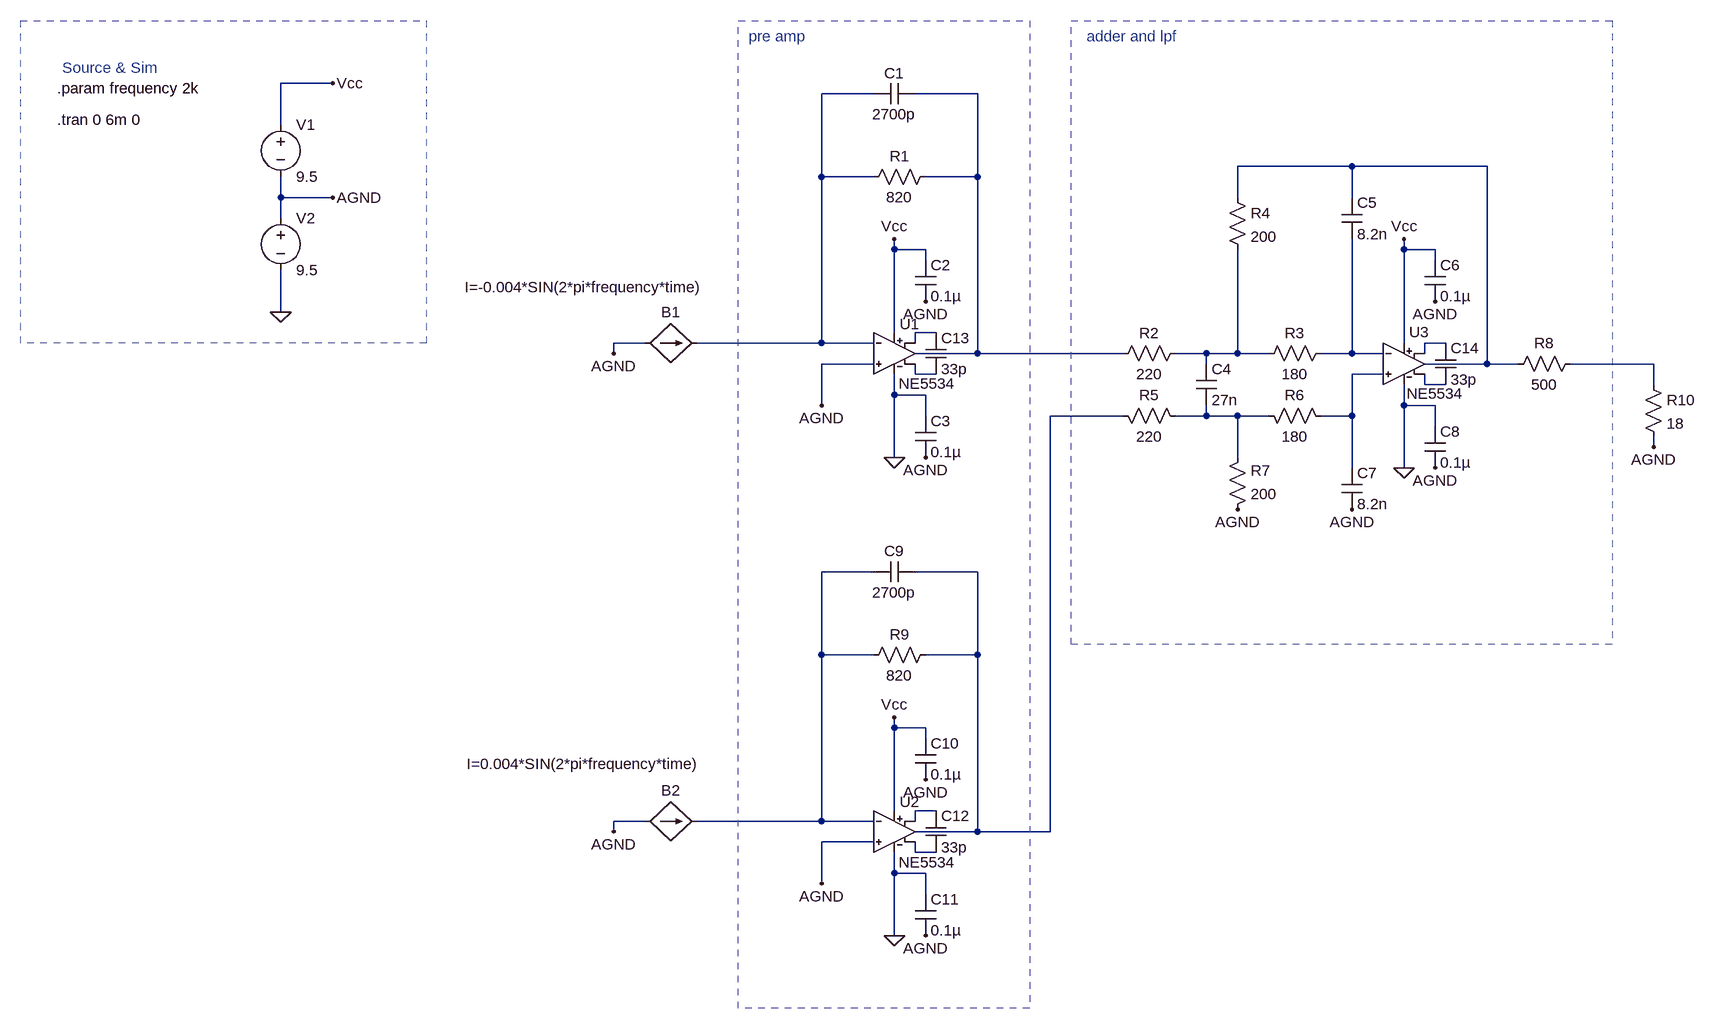
[diagram p0: schematic I-V_amp_stage.asc]
I-V_amp_stage.asc, the LTspice schematic file:
Version 4
SHEET 1 1436 1200
WIRE -672 -256 -752 -256
WIRE 160 -240 80 -240
WIRE 320 -240 224 -240
WIRE -752 -192 -752 -256
WIRE 896 -128 720 -128
WIRE 1104 -128 896 -128
WIRE 80 -112 80 -240
WIRE 160 -112 80 -112
WIRE 320 -112 320 -240
WIRE 320 -112 240 -112
WIRE -752 -80 -752 -112
WIRE -672 -80 -752 -80
WIRE 720 -80 720 -128
WIRE 896 -80 896 -128
WIRE -752 -48 -752 -80
WIRE 192 0 192 -16
WIRE 240 0 192 0
WIRE 976 0 976 -16
WIRE 1024 0 976 0
WIRE 240 16 240 0
WIRE 1024 16 1024 0
WIRE -752 96 -752 32
WIRE 192 128 192 0
WIRE 256 128 224 128
WIRE -192 144 -240 144
WIRE 80 144 80 -112
WIRE 80 144 -112 144
WIRE 160 144 80 144
WIRE 224 144 224 128
WIRE 976 144 976 0
WIRE 1040 144 1008 144
WIRE -240 160 -240 144
WIRE 320 160 320 -112
WIRE 320 160 224 160
WIRE 544 160 320 160
WIRE 672 160 624 160
WIRE 720 160 720 0
WIRE 720 160 672 160
WIRE 768 160 720 160
WIRE 896 160 896 -16
WIRE 896 160 848 160
WIRE 944 160 896 160
WIRE 1008 160 1008 144
WIRE 160 176 80 176
WIRE 672 176 672 160
WIRE 1104 176 1104 -128
WIRE 1104 176 1008 176
WIRE 1152 176 1104 176
WIRE 1360 176 1232 176
WIRE 224 192 224 176
WIRE 256 192 224 192
WIRE 944 192 896 192
WIRE 1008 208 1008 192
WIRE 1040 208 1008 208
WIRE 1360 208 1360 176
WIRE 192 224 192 192
WIRE 240 224 192 224
WIRE 80 240 80 176
WIRE 976 240 976 208
WIRE 1024 240 976 240
WIRE 240 256 240 224
WIRE 544 256 432 256
WIRE 672 256 672 240
WIRE 672 256 624 256
WIRE 720 256 672 256
WIRE 768 256 720 256
WIRE 896 256 896 192
WIRE 896 256 848 256
WIRE 1024 272 1024 240
WIRE 1360 304 1360 288
WIRE 192 320 192 224
WIRE 720 320 720 256
WIRE 896 336 896 256
WIRE 976 336 976 240
WIRE 160 496 80 496
WIRE 320 496 224 496
WIRE 80 624 80 496
WIRE 160 624 80 624
WIRE 320 624 320 496
WIRE 320 624 240 624
WIRE 192 736 192 720
WIRE 240 736 192 736
WIRE 240 752 240 736
WIRE 192 864 192 736
WIRE 256 864 224 864
WIRE -192 880 -240 880
WIRE 80 880 80 624
WIRE 80 880 -112 880
WIRE 160 880 80 880
WIRE 224 880 224 864
WIRE -240 896 -240 880
WIRE 320 896 320 624
WIRE 320 896 224 896
WIRE 432 896 432 256
WIRE 432 896 320 896
WIRE 160 912 80 912
WIRE 224 928 224 912
WIRE 256 928 224 928
WIRE 192 960 192 928
WIRE 240 960 192 960
WIRE 80 976 80 912
WIRE 240 992 240 960
WIRE 192 1056 192 960
FLAG 192 -16 Vcc
FLAG 976 -16 Vcc
FLAG 192 720 Vcc
FLAG -672 -80 AGND
FLAG -672 -256 Vcc
FLAG -240 896 AGND
FLAG 80 976 AGND
FLAG 240 1056 AGND
FLAG 240 320 AGND
FLAG 80 240 AGND
FLAG -240 160 AGND
FLAG 240 80 AGND
FLAG 720 400 AGND
FLAG 896 400 AGND
FLAG 1024 336 AGND
FLAG 1024 80 AGND
FLAG 240 816 AGND
FLAG 192 1056 0
FLAG 192 320 0
FLAG 976 336 0
FLAG -752 96 0
FLAG 1360 304 AGND
SYMBOL res 256 -128 R90
WINDOW 0 0 56 VBottom 2
WINDOW 3 32 56 VTop 2
SYMATTR InstName R1
SYMATTR Value 820
SYMBOL cap 224 -256 R90
WINDOW 0 0 32 VBottom 2
WINDOW 3 32 32 VTop 2
SYMATTR InstName C1
SYMATTR Value 2700p
SYMBOL cap 224 16 R0
SYMATTR InstName C2
SYMATTR Value 0.1µ
SYMBOL cap 224 256 R0
SYMATTR InstName C3
SYMATTR Value 0.1µ
SYMBOL res 640 144 R90
WINDOW 0 0 56 VBottom 2
WINDOW 3 32 56 VTop 2
SYMATTR InstName R2
SYMATTR Value 220
SYMBOL cap 656 176 R0
SYMATTR InstName C4
SYMATTR Value 27n
SYMBOL res 864 144 R90
WINDOW 0 0 56 VBottom 2
WINDOW 3 32 56 VTop 2
SYMATTR InstName R3
SYMATTR Value 180
SYMBOL res 704 -96 R0
SYMATTR InstName R4
SYMATTR Value 200
SYMBOL cap 880 -80 R0
SYMATTR InstName C5
SYMATTR Value 8.2n
SYMBOL cap 1008 16 R0
SYMATTR InstName C6
SYMATTR Value 0.1µ
SYMBOL res 640 272 M270
WINDOW 0 32 56 VTop 2
WINDOW 3 0 56 VBottom 2
SYMATTR InstName R5
SYMATTR Value 220
SYMBOL res 864 272 M270
WINDOW 0 32 56 VTop 2
WINDOW 3 0 56 VBottom 2
SYMATTR InstName R6
SYMATTR Value 180
SYMBOL res 704 416 M180
WINDOW 0 36 76 Left 2
WINDOW 3 36 40 Left 2
SYMATTR InstName R7
SYMATTR Value 200
SYMBOL cap 880 400 M180
WINDOW 0 24 56 Left 2
WINDOW 3 24 8 Left 2
SYMATTR InstName C7
SYMATTR Value 8.2n
SYMBOL cap 1008 272 R0
SYMATTR InstName C8
SYMATTR Value 0.1µ
SYMBOL res 1248 160 R90
WINDOW 0 0 56 VBottom 2
WINDOW 3 32 56 VTop 2
SYMATTR InstName R8
SYMATTR Value 500
SYMBOL res 256 608 R90
WINDOW 0 0 56 VBottom 2
WINDOW 3 32 56 VTop 2
SYMATTR InstName R9
SYMATTR Value 820
SYMBOL cap 224 480 R90
WINDOW 0 0 32 VBottom 2
WINDOW 3 32 32 VTop 2
SYMATTR InstName C9
SYMATTR Value 2700p
SYMBOL cap 224 752 R0
SYMATTR InstName C10
SYMATTR Value 0.1µ
SYMBOL cap 224 992 R0
SYMATTR InstName C11
SYMATTR Value 0.1µ
SYMBOL bi2 -112 144 R90
WINDOW 0 -32 40 VBottom 2
WINDOW 3 -102 174 VTop 2
SYMATTR InstName B1
SYMATTR Value I=-0.004*SIN(2*pi*frequency*time)
SYMBOL bi2 -112 880 R90
WINDOW 0 -32 40 VBottom 2
WINDOW 3 -104 175 VTop 2
SYMATTR InstName B2
SYMATTR Value I=0.004*SIN(2*pi*frequency*time)
SYMBOL NE5534TI 192 96 R0
WINDOW 0 8 19 Left 2
WINDOW 3 7 110 Left 2
SYMATTR InstName U1
SYMBOL NE5534TI 192 832 R0
WINDOW 0 8 18 Left 2
WINDOW 3 7 111 Left 2
SYMATTR InstName U2
SYMBOL NE5534TI 976 112 R0
WINDOW 0 8 15 Left 2
WINDOW 3 4 110 Left 2
SYMATTR InstName U3
SYMBOL cap 240 864 R0
SYMATTR InstName C12
SYMATTR Value 33p
SYMBOL cap 240 128 R0
SYMATTR InstName C13
SYMATTR Value 33p
SYMBOL cap 1024 144 R0
SYMATTR InstName C14
SYMATTR Value 33p
SYMBOL voltage -752 -208 R0
WINDOW 123 0 0 Left 0
WINDOW 39 24 44 Left 2
SYMATTR InstName V1
SYMATTR Value 9.5
SYMBOL voltage -752 -64 R0
WINDOW 123 0 0 Left 0
WINDOW 39 24 124 Left 2
SYMATTR InstName V2
SYMATTR Value 9.5
SYMBOL res 1344 192 R0
SYMATTR InstName R10
SYMATTR Value 18
TEXT -32 -328 Left 2 ;pre amp
TEXT 488 -328 Left 2 ;adder and lpf
TEXT -1096 -200 Left 2 !.tran 0 6m 0
TEXT -1096 -248 Left 2 !.param frequency 2k
TEXT -1088 -280 Left 2 ;Source & Sim
RECTANGLE Normal 400 1168 -48 -352 2
RECTANGLE Normal 1296 608 464 -352 2
RECTANGLE Normal -528 144 -1152 -352 2

The netlist it stands for:
* I-V_amp_stage.asc
R1 N002 N001 820
C1 N002 N001 2700p
C2 Vcc AGND 0.1µ
C3 0 AGND 0.1µ
R2 N006 N002 220
C4 N006 N013 27n
R3 N007 N006 180
R4 N003 N006 200
C5 N003 N007 8.2n
C6 Vcc AGND 0.1µ
R5 N013 N012 220
R6 N010 N013 180
R7 AGND N013 200
C7 AGND N010 8.2n
C8 0 AGND 0.1µ
R8 N008 N003 500
R9 N012 N014 820
C9 N012 N014 2700p
C10 Vcc AGND 0.1µ
C11 0 AGND 0.1µ
B1 AGND N001 I=-0.004*SIN(2*pi*frequency*time)
B2 AGND N014 I=0.004*SIN(2*pi*frequency*time)
XU1 AGND N001 Vcc 0 N002 N004 N009 NE5534  ; pins In+ In- V+ V- OUT comp+ comp-
XU2 AGND N014 Vcc 0 N012 N015 N016 NE5534  ; pins In+ In- V+ V- OUT comp+ comp-
XU3 N010 N007 Vcc 0 N003 N005 N011 NE5534  ; pins In+ In- V+ V- OUT comp+ comp-
C12 N015 N016 33p
C13 N004 N009 33p
C14 N005 N011 33p
V1 Vcc AGND 9.5
V2 AGND 0 9.5
R10 N008 AGND 18
* pre amp
* adder and lpf
.tran 0 6m 0
.param frequency 2k
* Source & Sim
.lib NE5534.sub
.backanno
.end